# Altium schematic sheet LED Driver.SchDoc
size 287 x 198 mm; SheetNumber: 4; SheetTotal: 4
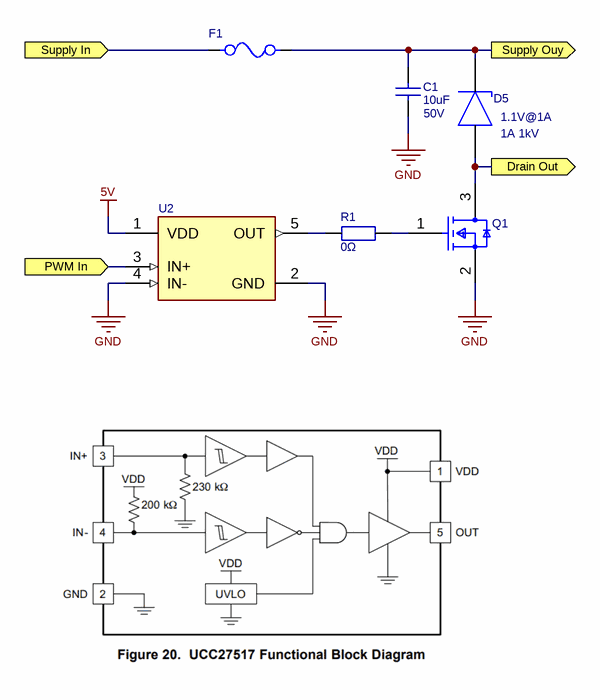
[diagram p0: LED Driver.SchDoc]

## Parts
C1  value 10uF  Rating: 50V  [CAPC3225X20N]
D5  value 1.1V@1A  Rating: 1A 1kV  [sod-123FL]
F1  (no value)  [FP-0685T-IPC_C]
Q1  (no value)  [SOT95P245X110-3N]
R1  value 0Ω  [RESC1005X04N]
U2  (no value)  [FP-DBV0005A-MFG]

## Ports
Drain Out (out), PWM In (in), Supply In (in), Supply Ouy (out)

## Nets
5V: U2.1(VDD)
GND: C1.1 Q1.2(S) U2.2(GND) U2.4(IN-)
Drain Out: D5.1(A) Q1.3(D) ; port Drain Out
PWM In: U2.3(IN+) ; port PWM In
Supply In: F1.1 ; port Supply In
Supply Ouy: C1.2 D5.2(C) F1.2 ; port Supply Ouy
NetQ1_1: Q1.1(G) R1.2
NetR1_1: R1.1 U2.5(OUT)

## Notes on the sheet
- Redako
- Keilestraat 5a, 3029BP, Rotterdam, M: david@redako.nl, T: +31 6 16001008
- Project
- Title
- Customer
- Size:
- Date:
- File:
- A4
- Revision:
- Time:
- Drawn by:
- GIT Revision:
- Sheet:
- of

## Library data of the parts
C1 = SMD_Cap: Package: 1210
D5 = d386f69c7d770905792c16b93fa31a7: 1A Independent Type 1kV 1.1V@1A SOD-123FL Diodes; MPN: SM4007PL
F1 = CMP-16042-000018-1: FUSE 3.0A 63VAC/DC SLOW 1206; MPN: 0468003.NRHF
Q1 = AO3400A: N-Channel 30V 5.7A 1.5V @ 250uA 26.5mΩ @ 5.7A,10V 1.4W SOT-23-3L MOSFET RoHS; Manufacturer: Alpha & Omega Semicon; Value: 5.7A @ 10V; MPN: AO3400A; Package: SOT-23-3L; JLC Part Type: Basic; JLCPCB Part #: C20917
R1 = Res: Package: 0402
U2 = CMP-04912-000015-1: IC GATE DVR LOW SIDE 1CH SOT23-5; Manufacturer: Texas Instruments; MPN: UCC27517DBVR; Package: DBV0005A